# EAGLE design pcf8591-board (EAGLE 6.3)
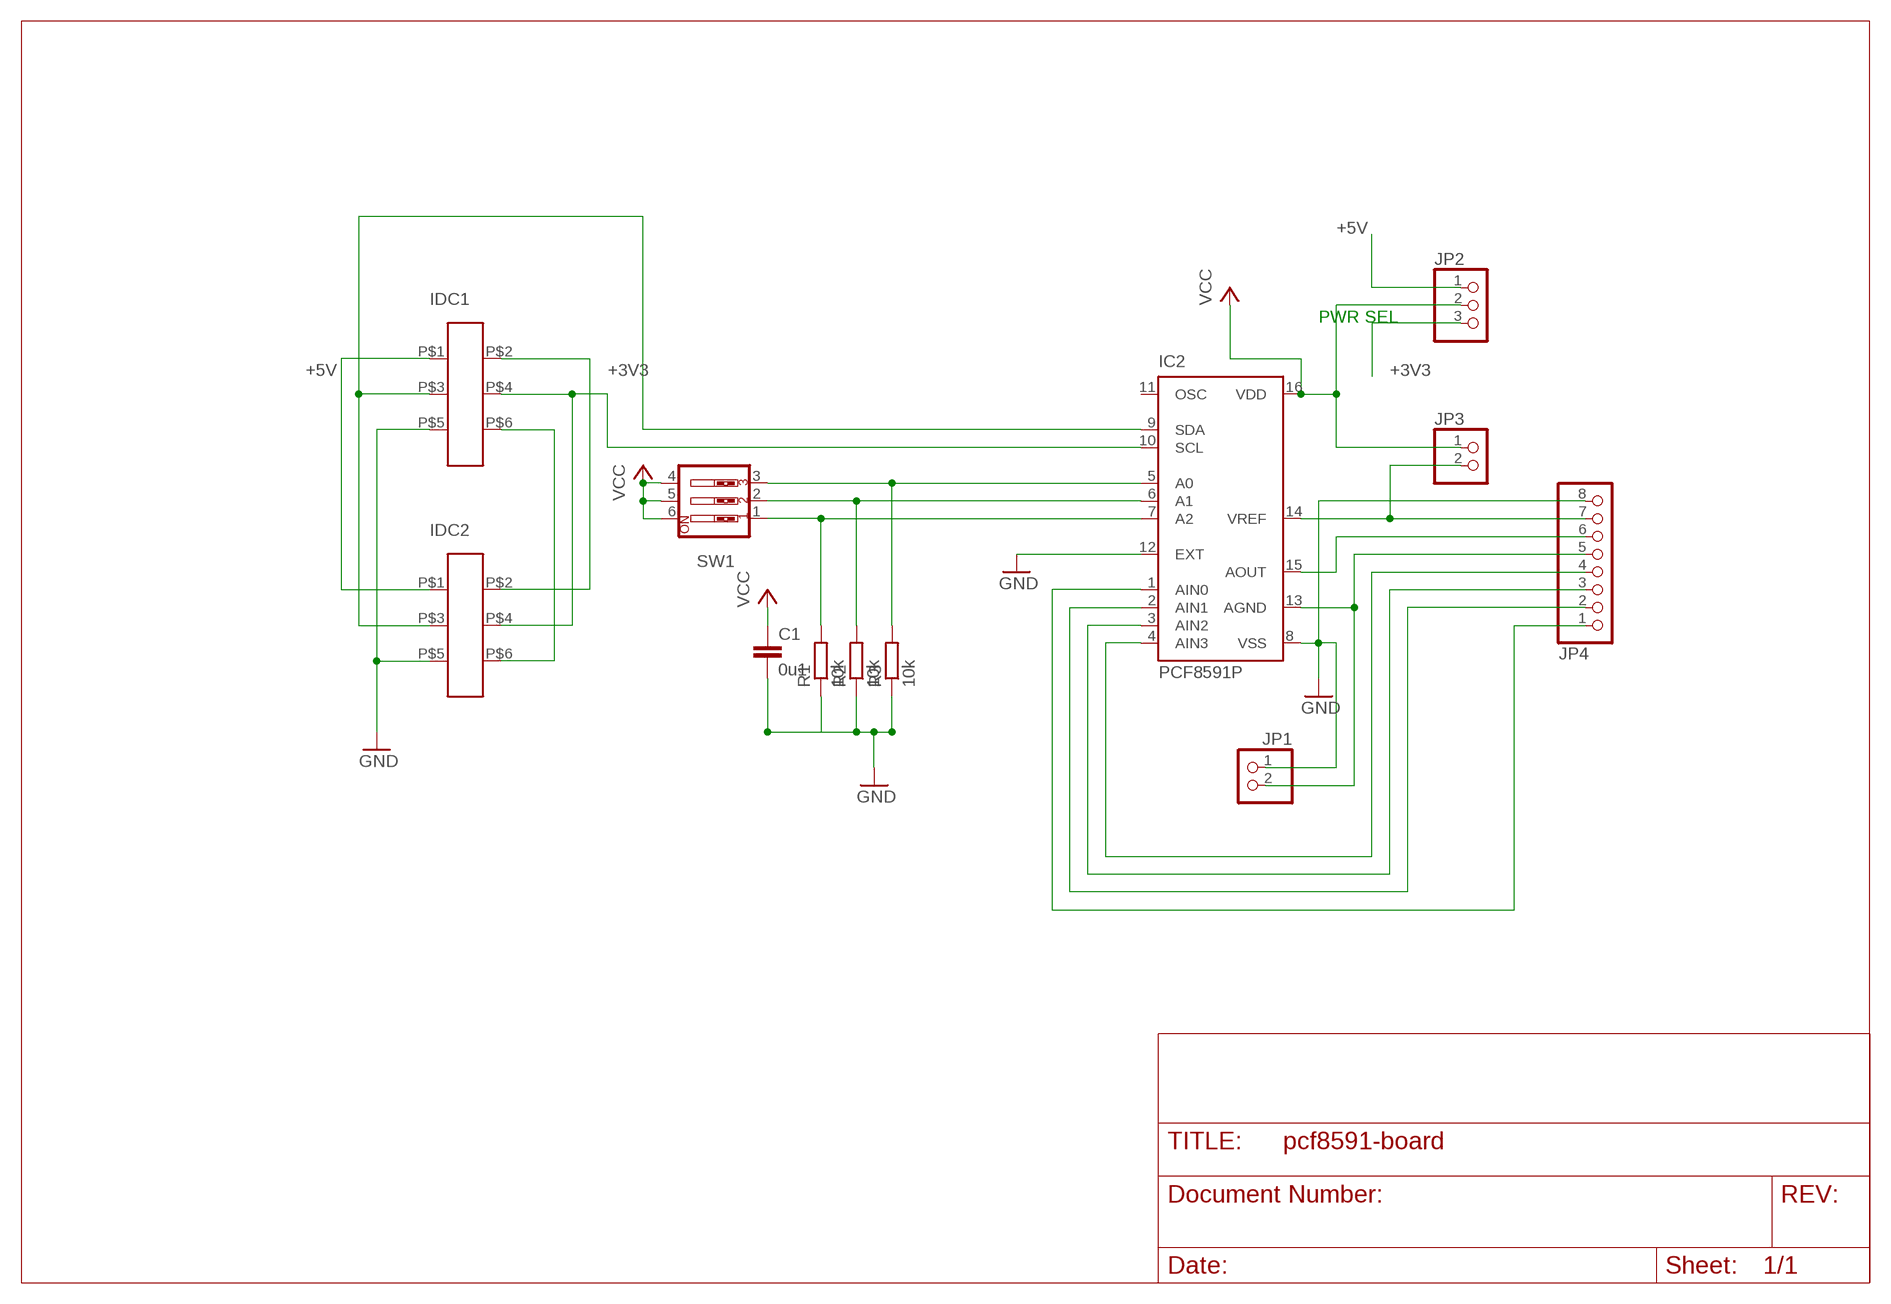
[diagram p0: schematic, sheet 1]

## Parts
C1  0u1  C-EU025-030X050  [C025-030X050]
IC2  PCF8591P  [DIL16]
IDC1  IDC-6W  [IDC-6W]
IDC2  IDC-6W  [IDC-6W]
JP1  PINHD-1X2  [1X02]
JP2  PINHD-1X3  [1X03]
JP3  PINHD-1X2  [1X02]
JP4  PINHD-1X8  [1X08]
R1  10k  R-EU_0204/7  [0204/7]
R2  10k  R-EU_0204/7  [0204/7]
R3  10k  R-EU_0204/7  [0204/7]
SW1  SW_DIP-3  [EDG-03]

## Nets
+3V3 [pwr]: IDC1.P$2 IDC2.P$2 JP2.3
+5V [pwr]: IDC1.P$1 IDC2.P$1 JP2.1
A0: IC2.7(A2) R1.2 SW1.1
A1: IC2.6(A1) R2.2 SW1.2
A2: IC2.5(A0) R3.2 SW1.3
GND [pwr]: C1.2 IC2.8(VSS) IC2.12(EXT) IDC1.P$5 IDC2.P$5 JP1.1 JP4.8 R1.1 R2.1 R3.1
N$1: IC2.1(AIN0) JP4.1
N$2: IC2.2(AIN1) JP4.2
N$3: IC2.3(AIN2) JP4.3
N$4: IC2.4(AIN3) JP4.4
N$5: IC2.13(AGND) JP1.2 JP4.5
N$6: IC2.15(AOUT) JP4.6
N$7: IC2.14(VREF) JP3.2 JP4.7
N$15: IDC1.P$6 IDC2.P$6
SCL: IC2.10(SCL) IDC1.P$4 IDC2.P$4
SDA: IC2.9(SDA) IDC1.P$3 IDC2.P$3
VCC [pwr]: C1.1 IC2.16(VDD) JP2.2 JP3.1 SW1.4 SW1.5 SW1.6
Unconnected: IC2.11(OSC)

## Notes on the sheet
- PWR SEL

## Library data of the parts
C1 = rcl:C-EU: CAPACITOR, European symbol
IC2 = micro-philips:PCF8591: I2C-Bus D/A CONVERTER; MF: FARNELL; MPN: PCF8591P; OC_FARNELL: 396412; OC_NEWARK: 07WX3385
IDC1 IDC2 = quick2wire:IDC-6W: 6 Way IDC Connector
JP1 JP3 = pinhead:PINHD-1X2: PIN HEADER
JP2 = pinhead:PINHD-1X3: PIN HEADER
JP4 = pinhead:PINHD-1X8: PIN HEADER
R1-R3 = rcl:R-EU_: RESISTOR, European symbol
SW1 = special:SW_DIP-3: DIP SWITCH

## Net classes
0 default: width 0.305 mm, clearance 0.127 mm
1 pwr: width 0.61 mm, clearance 0.254 mm

## Board
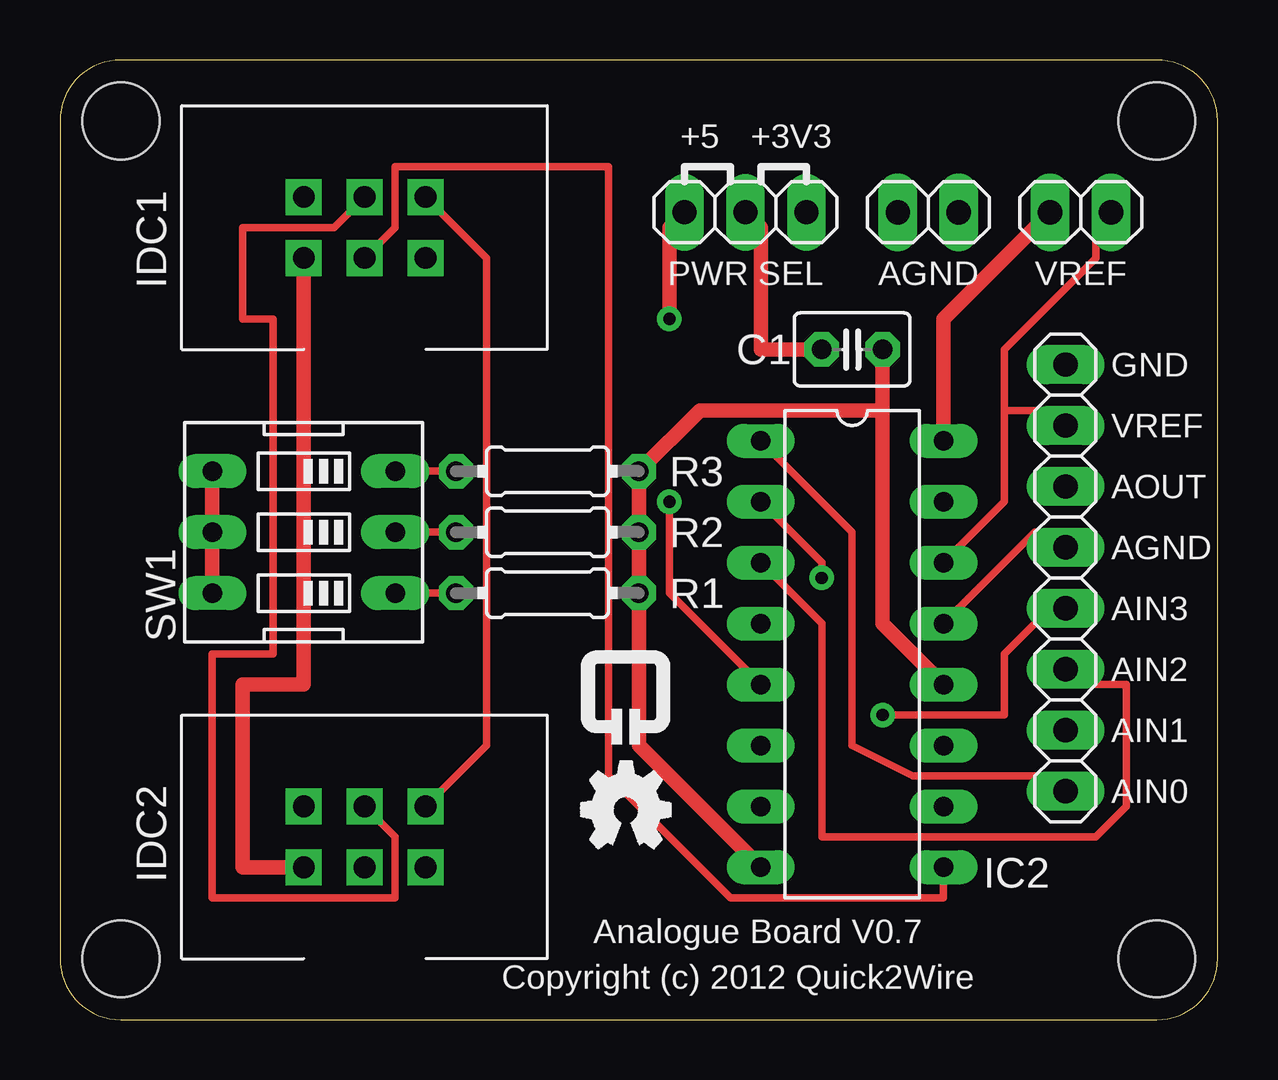
[diagram p1: board, top side]
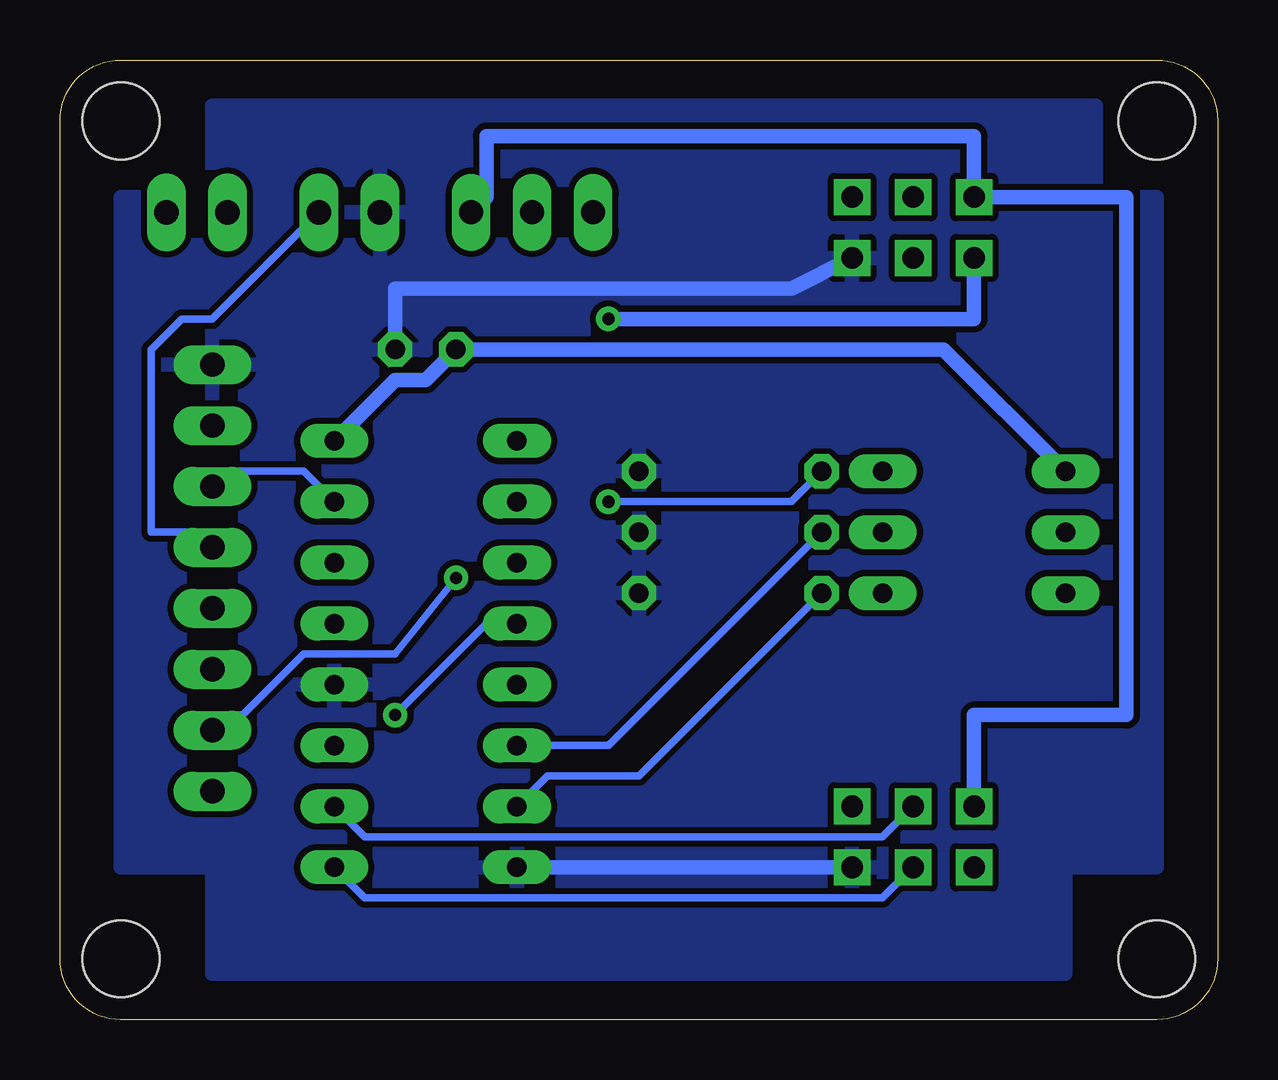
[diagram p2: board, bottom side, seen from below]

Size 48.26 x 40.01 mm. Coordinates in mm from the lower left corner, seen from the top.
Outline: 2.54,0 45.72,0 arc90 48.26,2.54 48.26,37.47 arc90 45.72,40.01 2.54,40.01 arc90 0,37.47 0,2.54 arc90 2.54,0
Copper layers (1*16): Top 0.035mm / dielectric 1.5mm / Bottom 0.035mm
Design rules "SparkFun": minimum track width 8mil, minimum drill 20mil, track to track 8mil, track to pad 8mil, pad to pad 8mil, via to via 8mil, smd to smd 8mil, copper to edge 10mil, drill to drill 8mil, minimum pad ring 12mil, minimum via ring 10mil, stop-mask expansion 4mil, vias tented up to drill 25mil, thermal gap 10mil
Holes 3.2 mm at 2.54,37.47 45.72,37.47 45.72,2.54 2.54,2.54

### Footprints (pad centres in the part's own frame; a part is rotated, then mirrored left to right if it is on the bottom)
C025-030X050 = drill 0.813 octagon: 1 -1.27,0; 2 1.27,0
DIL16 = drill 0.813 long: 1 -8.89,-3.81; 2 -6.35,-3.81; 3 -3.81,-3.81; 4 -1.27,-3.81; 5 1.27,-3.81; 6 3.81,-3.81; 7 6.35,-3.81; 8 8.89,-3.81; 9 8.89,3.81; 10 6.35,3.81; 11 3.81,3.81; 12 1.27,3.81; 13 -1.27,3.81; 14 -3.81,3.81; 15 -6.35,3.81; 16 -8.89,3.81
IDC-6W = drill 0.9 square: P$1 -1.27,2.54; P$2 1.27,2.54; P$3 -1.27,0; P$4 1.27,0; P$5 -1.27,-2.54; P$6 1.27,-2.54
1X02 = drill 1.016 long: 1 -1.27,0; 2 1.27,0
1X03 = drill 1 long: 1 -2.54,0; 2 0,0; 3 2.54,0
1X08 = drill 1.016 long: 1 -8.89,0; 2 -6.35,0; 3 -3.81,0; 4 -1.27,0; 5 1.27,0; 6 3.81,0; 7 6.35,0; 8 8.89,0
0204/7 = drill 0.813 octagon: 1 -3.81,0; 2 3.81,0
EDG-03 = drill 0.813 long: 1 -2.54,-3.81; 2 0,-3.81; 3 2.54,-3.81; 4 2.54,3.81; 5 0,3.81; 6 -2.54,3.81

### Placement (x,y rotation side)
C1  33.02,27.94 0 top
IC2  33.02,15.24 270 top
IDC1  12.7,33.02 90 top
IDC2  12.7,7.62 90 top
JP1  36.2,33.66 0 top
JP2  28.57,33.66 0 top
JP3  42.55,33.66 0 top
JP4  41.91,18.41 90 top
R1  20.32,17.78 180 top
R2  20.32,20.32 180 top
R3  20.32,22.86 180 top
SW1  10.16,20.32 90 top
U$1  [QUICK2WIRE-LOGO]  21.59,11.43 0 top
U$2  [OSHW-LOGO]  21.59,6.99 0 top

### Tracks (layer width: path | path; a pad name or v marks a point on that pad's centre or on a via)
+3V3
  Bottom 0.61: IDC2.P$2 10.16,12.7 3.81,12.7 3.81,34.29 IDC1.P$2 10.16,36.83 30.48,36.83 30.48,34.29 JP2.3
+5V  (via drill 0.51)
  Top 0.61: IDC2.P$1 7.62,6.35 7.62,13.97 10.16,13.97 IDC1.P$1 | v25.4,29.21 25.4,33.02 JP2.1
  Bottom 0.61: v25.4,29.21 10.16,29.21 IDC1.P$1
A0
  Top 0.305: R1.2 SW1.1
  Bottom 0.305: IC2.7 27.94,10.16 24.13,10.16 R1.2
A1
  Top 0.305: R2.2 SW1.2
  Bottom 0.305: IC2.6 25.4,11.43 R2.2
A2  (via drill 0.51)
  Top 0.305: R3.2 SW1.3 | IC2.5 25.4,17.78 v25.4,21.59
  Bottom 0.305: v25.4,21.59 17.78,21.59 R3.2
GND
  Top 0.61: IC2.8 24.13,11.43 R1.1 R2.1 R3.1 26.67,25.4 34.29,25.4 | IC2.12 34.29,16.51 34.29,25.4 | C1.2 34.29,25.4
  Bottom 0.61: IC2.8 IDC2.P$5 | IDC1.P$5 17.78,30.48 34.29,30.48 C1.2
  pour Bottom: 2.54,34.29 5.08,34.29 5.08,38.1 41.91,38.1 41.91,34.29 45.72,34.29 45.72,6.35 41.91,6.35 41.91,1.91 6.35,1.91 6.35,6.35 2.54,6.35
N$1
  Top 0.305: IC2.1 33.02,20.32 33.02,11.43 35.56,10.16 41.91,10.16 JP4.1
N$2  (via drill 0.51)
  Top 0.305: v31.75,18.41 31.75,19.05 IC2.2
  Bottom 0.305: v31.75,18.41 34.29,15.24 38.1,15.24 40.64,12.7 41.91,12.7 JP4.2
N$3
  Top 0.305: IC2.3 31.75,16.51 31.75,7.62 43.18,7.62 44.45,8.89 44.45,13.97 41.91,13.97 JP4.3
N$4  (via drill 0.51)
  Top 0.305: v34.29,12.7 39.37,12.7 39.37,15.24 41.91,17.78 JP4.4
  Bottom 0.305: IC2.4 30.48,16.51 v34.29,12.7
N$5
  Top 0.305: IC2.13 40.64,20.32 41.91,20.32 JP4.5
  Bottom 0.305: JP1.2 41.91,29.21 43.18,29.21 44.45,27.94 44.45,20.32 41.91,20.32 JP4.5
N$6
  Bottom 0.305: IC2.15 38.1,22.86 41.91,22.86 JP4.6
N$7
  Top 0.305: IC2.14 39.37,21.59 39.37,25.4 | 39.37,25.4 39.37,27.94 43.18,31.75 43.18,33.02 JP3.2 | 39.37,25.4 41.91,25.4 JP4.7
N$15
  Top 0.305: IDC2.P$6 17.78,11.43 17.78,31.75 IDC1.P$6
SCL
  Top 0.305: IDC1.P$4 11.43,33.02 7.62,33.02 7.62,29.21 8.89,29.21 8.89,15.24 6.35,15.24 6.35,5.08 13.97,5.08 13.97,7.62 IDC2.P$4
  Bottom 0.305: IC2.10 35.56,7.62 13.97,7.62 IDC2.P$4
SDA
  Top 0.305: IDC1.P$3 13.97,33.02 13.97,35.56 22.86,35.56 22.86,10.16 27.94,5.08 36.83,5.08 IC2.9
  Bottom 0.305: IC2.9 35.56,5.08 13.97,5.08 IDC2.P$3
VCC
  Top 0.61: SW1.6 SW1.5 SW1.4 | C1.1 29.21,27.94 29.21,33.02 JP2.2 | JP3.1 36.83,29.21 IC2.16
  Bottom 0.61: IC2.16 34.29,26.67 33.02,26.67 C1.1 11.43,27.94 SW1.4

### Text on the board
tPlace: +5 | +3V3 | PWR SEL | Analogue Board V0.7 | Copyright (c) 2012 Quick2Wire
tNames: AGND | VREF | GND | VREF | AOUT | AGND | AIN3 | AIN2 | AIN1 | AIN0